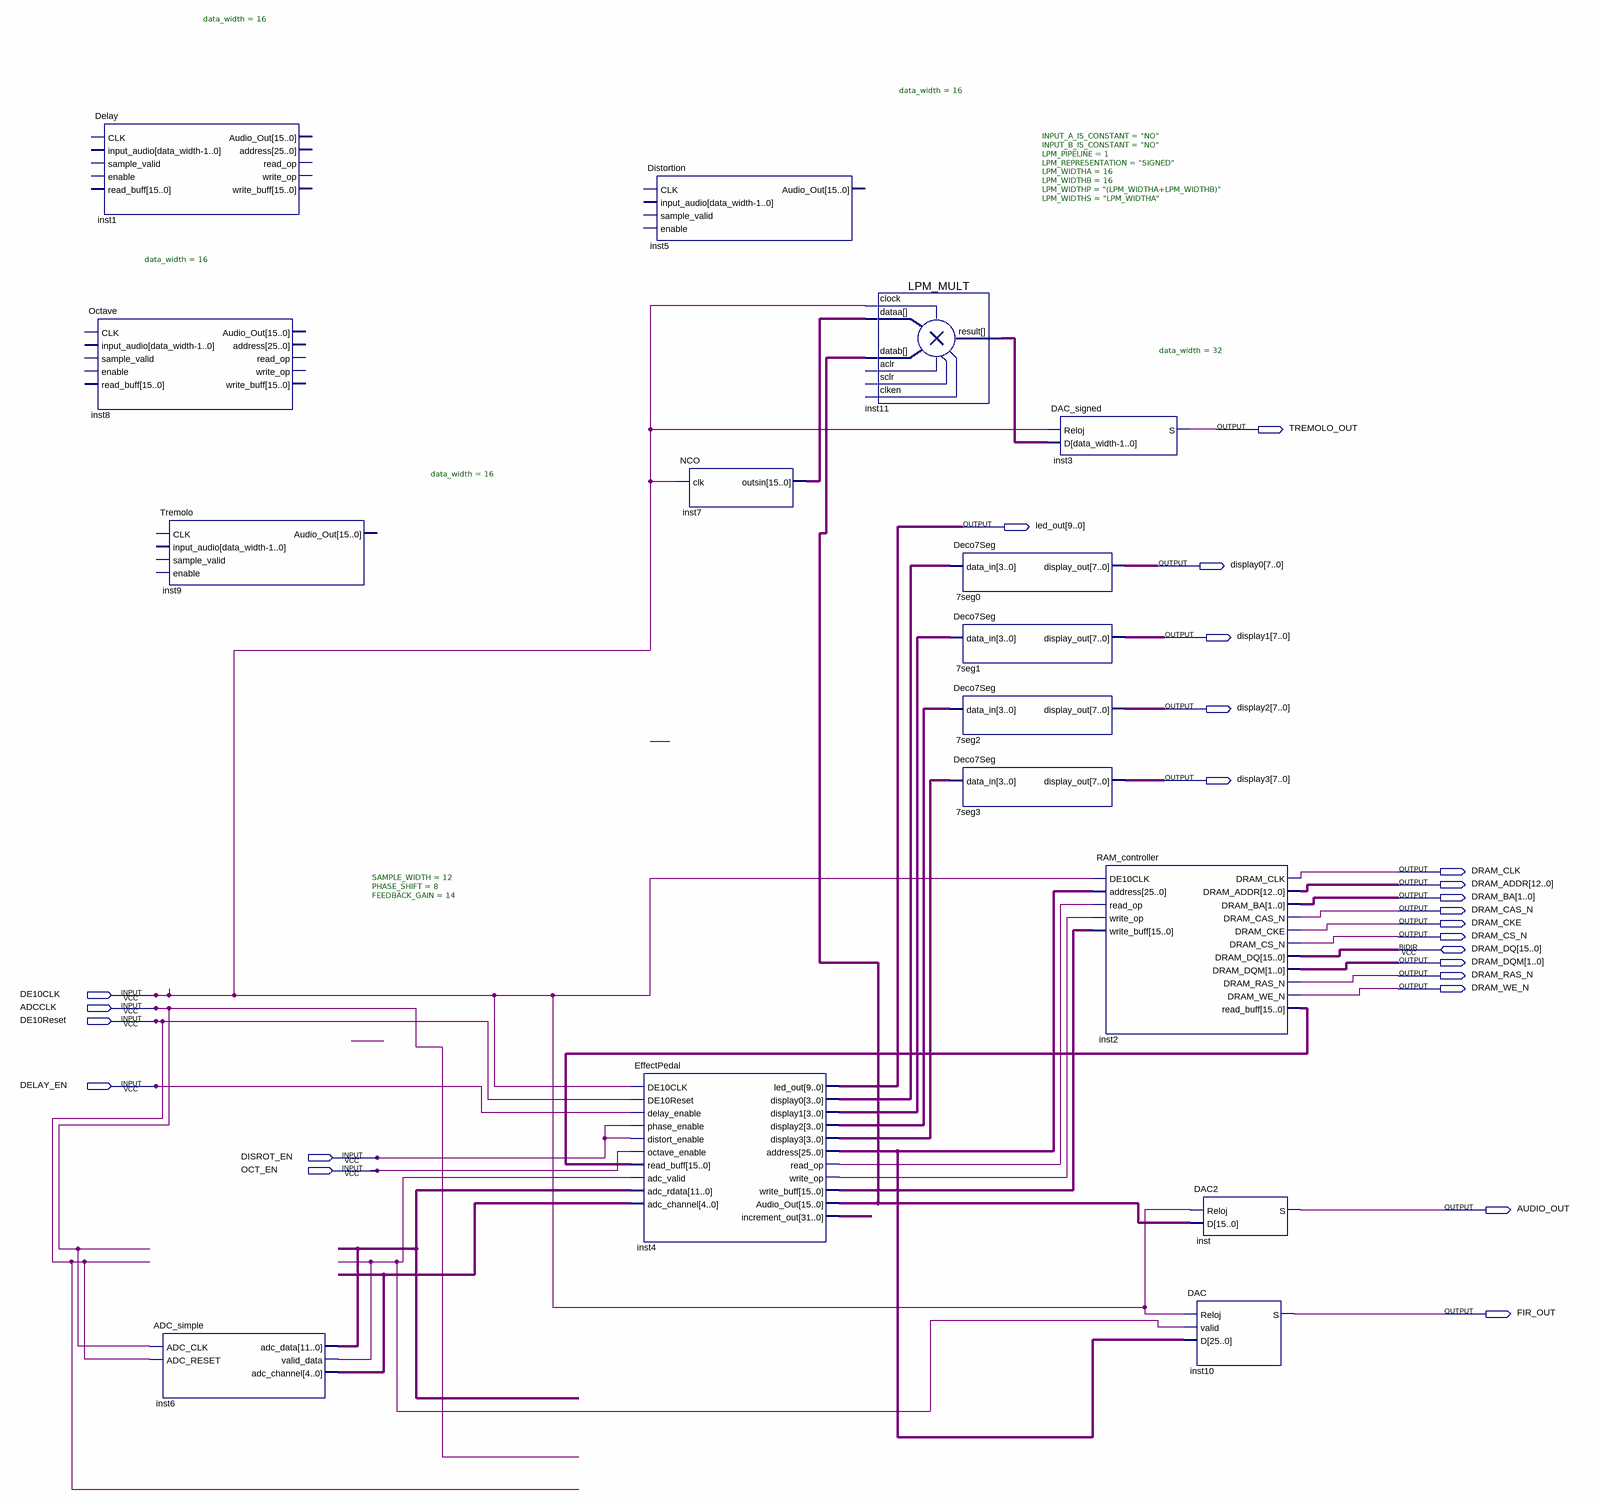
[diagram p0: schematic sheet]
// Quartus schematic Effects_Pedal_OG.bdf as structural Verilog: 16 symbols, 24 pins
module Effects_Pedal_OG (
  input  DE10CLK,
  input  ADCCLK,
  input  DE10Reset,
  input  DELAY_EN,
  input  DISROT_EN,
  input  OCT_EN,
  inout  [15:0] DRAM_DQ,
  output TREMOLO_OUT,
  output [9:0] led_out,
  output [7:0] display0,
  output [7:0] display1,
  output [7:0] display2,
  output [7:0] display3,
  output DRAM_CLK,
  output [12:0] DRAM_ADDR,
  output [1:0] DRAM_BA,
  output DRAM_CAS_N,
  output DRAM_CKE,
  output DRAM_CS_N,
  output [1:0] DRAM_DQM,
  output DRAM_RAS_N,
  output DRAM_WE_N,
  output AUDIO_OUT,
  output FIR_OUT
);

  wire inst4_read_op, inst4_write_op, inst6_valid_data;
  wire [3:0] inst4_display0, inst4_display1, inst4_display2, inst4_display3;
  wire [4:0] inst6_adc_channel;
  wire [11:0] inst6_adc_data;
  wire [15:0] inst2_read_buff, inst4_audio_out, inst4_write_buff, inst7_outsin;
  wire [25:0] inst4_address;
  wire [31:0] inst4_increment_out, inst11_result;

  Delay #(.data_width(16)) inst1 ();  // open: CLK, input_audio, sample_valid, enable, read_buff, Audio_Out, address, read_op, write_op, write_buff
  Octave #(.data_width(16)) inst8 ();  // open: CLK, input_audio, sample_valid, enable, read_buff, Audio_Out, address, read_op, write_op, write_buff
  Tremolo #(.data_width(16)) inst9 ();  // open: CLK, input_audio, sample_valid, enable, Audio_Out
  ADC_simple inst6 (
    .ADC_CLK(ADCCLK), .ADC_RESET(DE10Reset), .adc_data(inst6_adc_data), .valid_data(inst6_valid_data),
    .adc_channel(inst6_adc_channel));
  Distortion #(.data_width(16)) inst5 ();  // open: CLK, input_audio, sample_valid, enable, Audio_Out
  EffectPedal #(.SAMPLE_WIDTH(12), .PHASE_SHIFT(8), .FEEDBACK_GAIN(14)) inst4 (
    .DE10CLK(DE10CLK), .DE10Reset(DE10Reset), .delay_enable(DELAY_EN), .phase_enable(DISROT_EN),
    .distort_enable(DISROT_EN), .octave_enable(OCT_EN), .read_buff(inst2_read_buff),
    .adc_valid(inst6_valid_data), .adc_rdata(inst6_adc_data), .adc_channel(inst6_adc_channel),
    .led_out(led_out), .display0(inst4_display0), .display1(inst4_display1), .display2(inst4_display2),
    .display3(inst4_display3), .address(inst4_address), .read_op(inst4_read_op), .write_op(inst4_write_op),
    .write_buff(inst4_write_buff), .Audio_Out(inst4_audio_out), .increment_out(inst4_increment_out));
  NCO inst7 (.clk(DE10CLK), .outsin(inst7_outsin));
  LPM_MULT #(.INPUT_A_IS_CONSTANT("NO"), .INPUT_B_IS_CONSTANT("NO"), .LPM_PIPELINE(1), .LPM_REPRESENTATION("SIGNED"), .LPM_WIDTHA(16), .LPM_WIDTHB(16), .LPM_WIDTHP("(LPM_WIDTHA+LPM_WIDTHB)"), .LPM_WIDTHS("LPM_WIDTHA")) inst11 (
    .clock(DE10CLK), .dataa(inst7_outsin), .datab(inst4_audio_out), .result(inst11_result));  // open: aclr, sclr, clken
  Deco7Seg u_7seg0 (.data_in(inst4_display0), .display_out(display0));
  Deco7Seg u_7seg1 (.data_in(inst4_display1), .display_out(display1));
  Deco7Seg u_7seg2 (.data_in(inst4_display2), .display_out(display2));
  Deco7Seg u_7seg3 (.data_in(inst4_display3), .display_out(display3));
  DAC_signed #(.data_width(32)) inst3 (.Reloj(DE10CLK), .D(inst11_result), .S(TREMOLO_OUT));
  RAM_controller inst2 (
    .DE10CLK(DE10CLK), .address(inst4_address), .read_op(inst4_read_op), .write_op(inst4_write_op),
    .write_buff(inst4_write_buff), .DRAM_CLK(DRAM_CLK), .DRAM_ADDR(DRAM_ADDR), .DRAM_BA(DRAM_BA),
    .DRAM_CAS_N(DRAM_CAS_N), .DRAM_CKE(DRAM_CKE), .DRAM_CS_N(DRAM_CS_N), .DRAM_DQM(DRAM_DQM),
    .DRAM_RAS_N(DRAM_RAS_N), .DRAM_WE_N(DRAM_WE_N), .read_buff(inst2_read_buff), .DRAM_DQ(DRAM_DQ));
  DAC2 inst (.Reloj(DE10CLK), .D(inst4_audio_out), .S(AUDIO_OUT));
  DAC inst10 (.Reloj(DE10CLK), .valid(inst6_valid_data), .D(inst4_address), .S(FIR_OUT));
endmodule
